# EAGLE design controler scr (EAGLE 7.4.0)
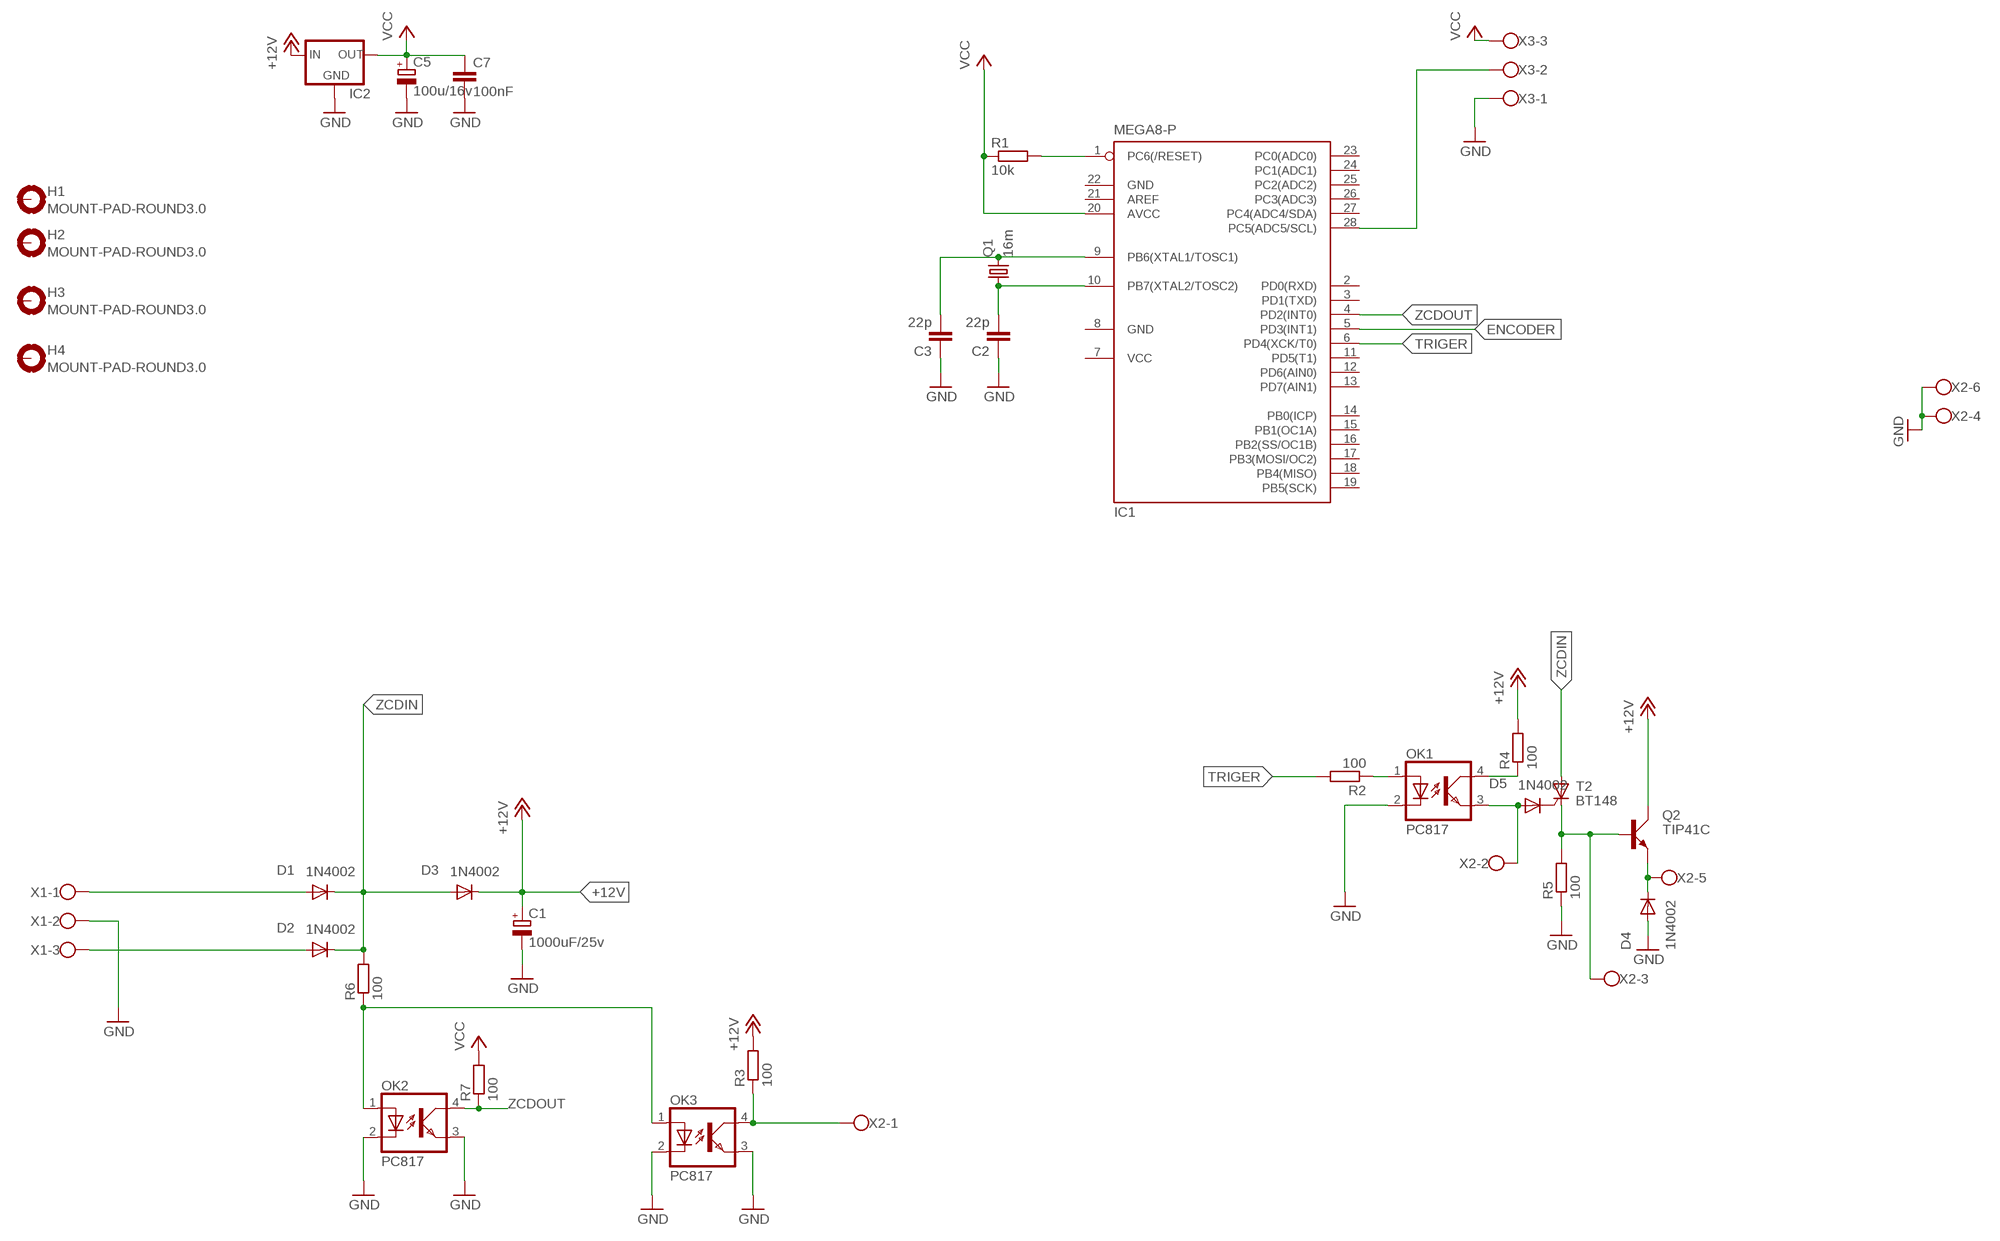
[diagram p0: schematic, sheet 1]

## Parts
C1  1000uF/25v  CPOL-EUE5-10.5  [E5-10,5]
C2  22p  C-EU025-025X050  [C025-025X050]
C3  22p  C-EU025-025X050  [C025-025X050]
C5  100u/16v  CPOL-EUE2.5-5  [E2,5-5]
C7  100nF  C-EU025-025X050  [C025-025X050]
D1  1N4002  1N4446  [DO35-10]
D2  1N4002  1N4446  [DO35-10]
D3  1N4002  1N4446  [DO35-10]
D4  1N4002  1N4446  [DO35-10]
D5  1N4002  1N4446  [DO35-10]
H1  MOUNT-PAD-ROUND3.0  [3,0-PAD]
H2  MOUNT-PAD-ROUND3.0  [3,0-PAD]
H3  MOUNT-PAD-ROUND3.0  [3,0-PAD]
H4  MOUNT-PAD-ROUND3.0  [3,0-PAD]
IC1  MEGA8-P  [DIL28-3]
IC2  78XXS  [78XXS]
OK1  PC817  [DIL04]
OK2  PC817  [DIL04]
OK3  PC817  [DIL04]
Q1  16m  CRYSTALHC49U-V  [HC49U-V]
Q2  TIP41C  [TO220AV]
R1  10k  R-EU_0207/10  [0207/10]
R2  100  R-EU_0207/10  [0207/10]
R3  100  R-EU_0207/10  [0207/10]
R4  100  R-EU_0207/10  [0207/10]
R5  100  R-EU_0207/10  [0207/10]
R6  100  R-EU_0207/10  [0207/10]
R7  100  R-EU_0207/10  [0207/10]
T2  BT148  [SOT82S]
X1  W237-103  [W237-103]
X2  W237-6  [W237-6]
X3  W237-103  [W237-103]

## Nets
+12V: C1.+ D3.C IC2.IN Q2.C R3.2 R4.2
CTA: D1.A X1.1
CTB: D2.A X1.3
ENCODER: IC1.5(PD3(INT1))
GND: C1.- C2.1 C3.1 C5.- C7.2 D4.A IC2.GND OK1.2(C) OK2.2(C) OK2.3(EMIT) OK3.2(C) OK3.3(EMIT) R5.1 X1.2 X2.4 X2.6 X3.1
N$1: IC1.1(PC6(/RESET)) R1.2
N$2: IC1.28(PC5(ADC5/SCL)) X3.2
N$3: D5.C T2.G
N$4: OK2.1(A) OK3.1(A) R6.1
N$5: D4.C Q2.E X2.5
N$6: C3.2 IC1.9(PB6(XTAL1/TOSC1)) Q1.2
N$7: OK3.4(COL) R3.1 X2.1
N$8: C2.2 IC1.10(PB7(XTAL2/TOSC2)) Q1.1
N$9: D5.A OK1.3(EMIT) X2.2
N$10: OK1.4(COL) R4.1
N$20: Q2.B R5.2 T2.C X2.3
N$21: OK1.1(A) R2.1
TRIGER: IC1.6(PD4(XCK/T0)) R2.2
VCC: C5.+ C7.1 IC1.20(AVCC) IC2.OUT R1.1 R7.2 X3.3
ZCDIN: D1.C D2.C D3.A R6.2 T2.A
ZCDOUT: IC1.4(PD2(INT0)) OK2.4(COL) R7.1
Unconnected: H1.B3,0(MOUNT) H2.B3,0(MOUNT) H3.B3,0(MOUNT) H4.B3,0(MOUNT) IC1.2(PD0(RXD)) IC1.3(PD1(TXD)) IC1.11(PD5(T1)) IC1.12(PD6(AIN0)) IC1.13(PD7(AIN1)) IC1.14(PB0(ICP)) IC1.15(PB1(OC1A)) IC1.16(PB2(SS/OC1B)) IC1.17(PB3(MOSI/OC2)) IC1.18(PB4(MISO)) IC1.19(PB5(SCK)) IC1.21(AREF) IC1.23(PC0(ADC0)) IC1.24(PC1(ADC1)) IC1.25(PC2(ADC2)) IC1.26(PC3(ADC3)) IC1.27(PC4(ADC4/SDA))

## Power pins joined to a net without a drawn wire
GND: IC1.8(GND) IC1.22(GND)
VCC: IC1.7(VCC)

## Library data of the parts
C1 C5 = rcl:CPOL-EU: POLARIZED CAPACITOR, European symbol
C2 C3 C7 = rcl:C-EU: CAPACITOR, European symbol
D1-D5 = diode:1N4446: DIODE high speed (Philips)
H1-H4 = holes:MOUNT-PAD-ROUND: MOUNTING PAD, round
IC1 = atmel:MEGA8-P: MICROCONTROLLER 8 Kbytes FLASH, 1 kbytes SRAM, 512 bytes EEPROM, USART, 4-channel 10 bit ADC, 2-channel 8 bit ADC Pin compatible with Atmega48, ATMega88, ATMega168 Source: avr.lbr; OC_FARNELL: unknown; OC_NEWARK: unknown
IC2 = v-reg:78XXS: VOLTAGE REGULATOR
OK1-OK3 = optocoupler:PC817: SHARP OPTO COUPLER; MPN: PC817X4J000F; OC_FARNELL: 9707727; OC_NEWARK: 97K7059
Q1 = crystal:CRYSTAL: CRYSTAL; OC_FARNELL: 1666969; OC_NEWARK: unknown
Q2 = transistor-power:TIP41C: NPN TRANSISTOR
R1-R7 = rcl:R-EU_: RESISTOR, European symbol
T2 = triac:BT148: THYRISTOR
X1 X3 = con-wago-500:W237-103: WAGO SCREW CLAMP; MPN: 237-103; OC_FARNELL: unknown; OC_NEWARK: 18M7116
X2 = con-wago-500:W237-6: WAGO SCREW CLAMP; OC_FARNELL: unknown; OC_NEWARK: unknown

## Board
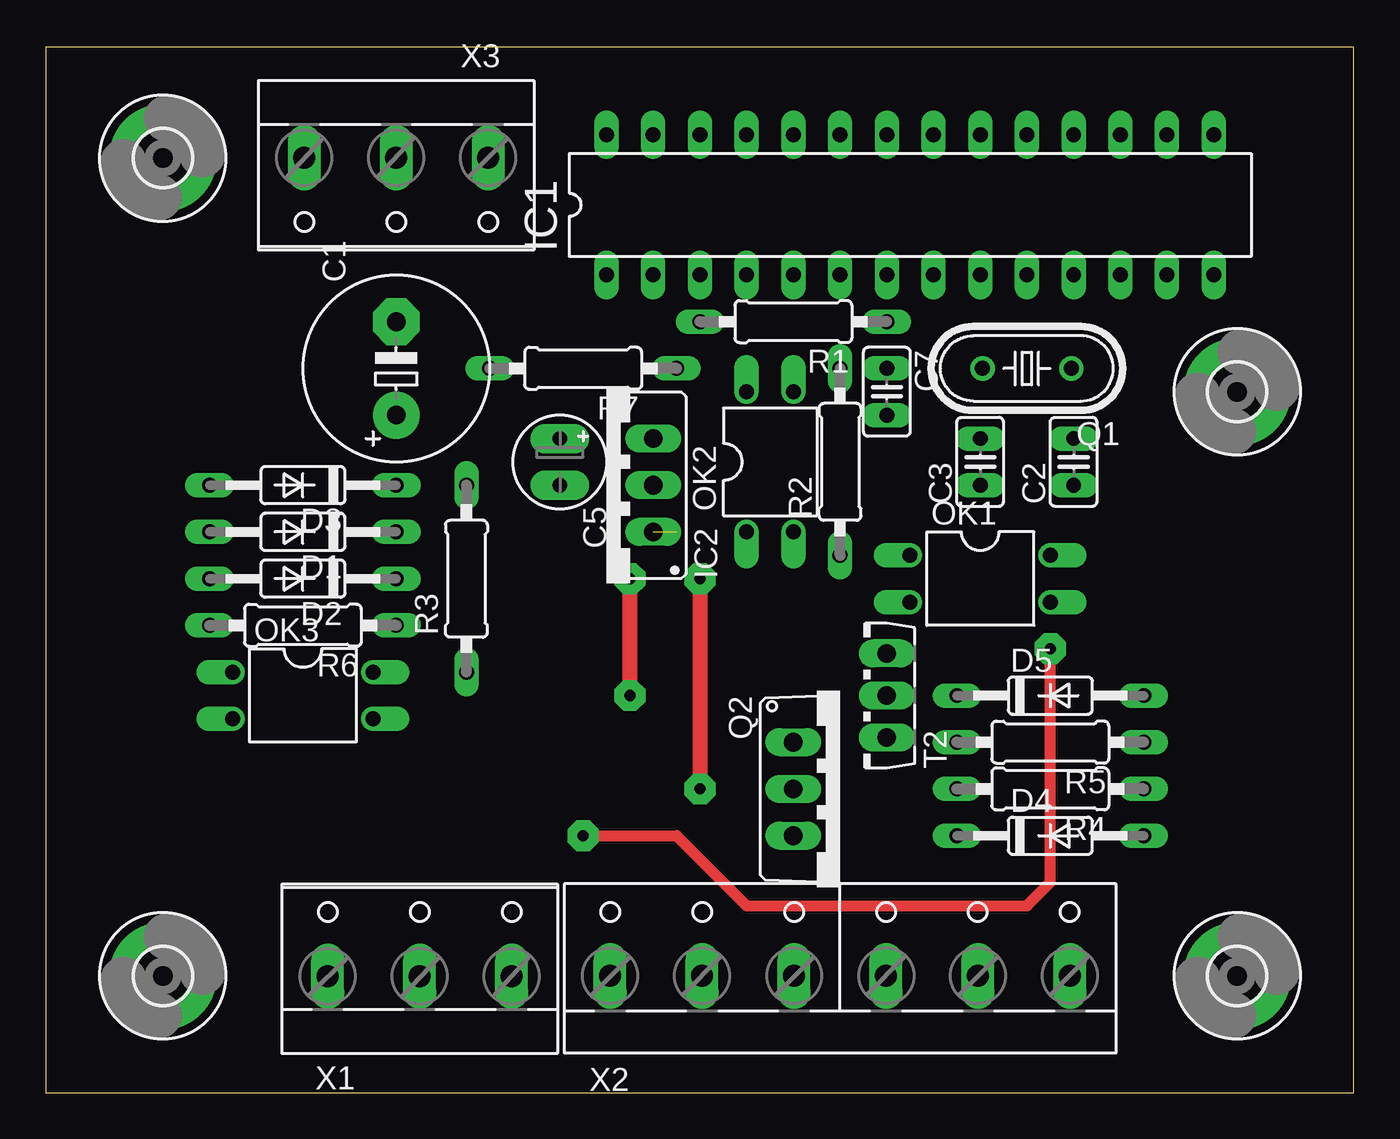
[diagram p1: board, top side]
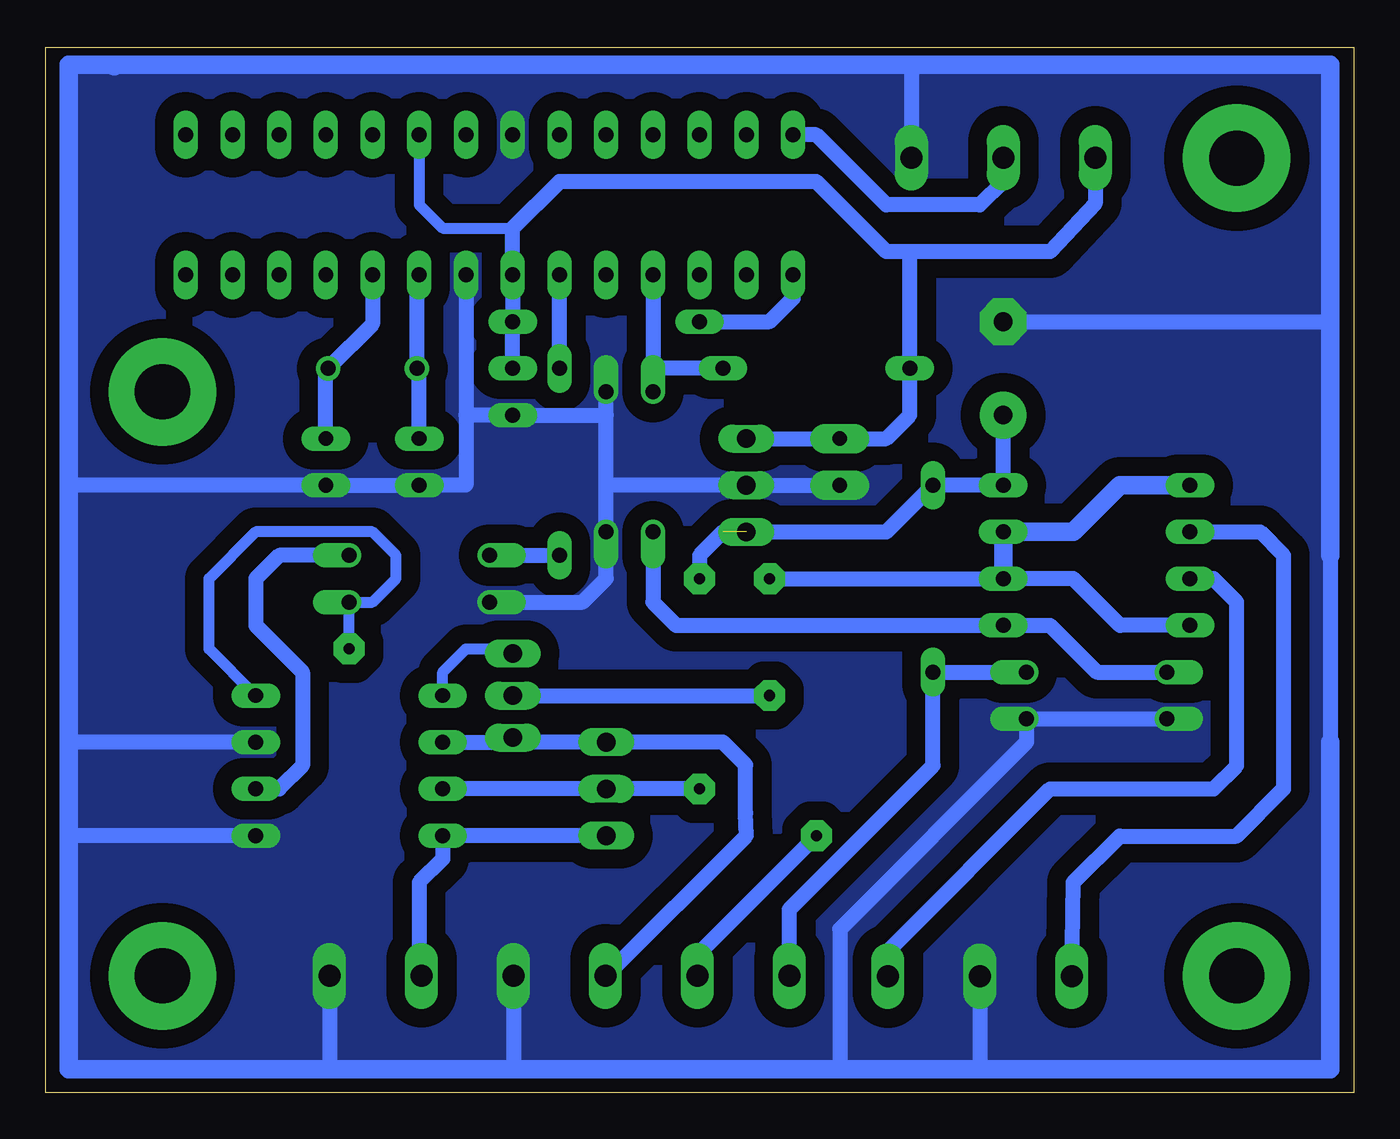
[diagram p2: board, bottom side, seen from below]

Size 71.1 x 56.82 mm. Coordinates in mm from the lower left corner, seen from the top.
Outline: 0,0 71.1,0 71.1,56.82 0,56.82 0,0
Copper layers (1*16): Top 0.035mm / dielectric 1.5mm / Bottom 0.035mm
Design rules "default": minimum track width 10mil, minimum drill 24mil, track to track 8mil, track to pad 8mil, pad to pad 8mil, via to via 8mil, smd to smd 8mil, copper to edge 40mil, drill to drill 8mil, minimum pad ring 10mil, minimum via ring 8mil, stop-mask expansion 4mil, vias tented up to drill 0mil, thermal gap 10mil

### Footprints (pad centres in the part's own frame; a part is rotated, then mirrored left to right if it is on the bottom)
E5-10,5 = drill 1.016 pad 2.54: + -2.54,0 | drill 1.016 pad 2.54 octagon: - 2.54,0
C025-025X050 = drill 0.813 long: 1 -1.27,0; 2 1.27,0
E2,5-5 = drill 0.813 pad 1.6 long: + -1.27,0; - 1.27,0
DO35-10 = drill 0.813 long: A 5.08,0; C -5.08,0
3,0-PAD = drill 3 pad 5.842: B3,0 0,0
DIL28-3 = drill 0.813 long: 1 -16.51,-3.81; 2 -13.97,-3.81; 3 -11.43,-3.81; 4 -8.89,-3.81; 5 -6.35,-3.81; 6 -3.81,-3.81; 7 -1.27,-3.81; 8 1.27,-3.81; 9 3.81,-3.81; 10 6.35,-3.81; 11 8.89,-3.81; 12 11.43,-3.81; 13 13.97,-3.81; 14 16.51,-3.81; 15 16.51,3.81; 16 13.97,3.81; 17 11.43,3.81; 18 8.89,3.81; 19 6.35,3.81; 20 3.81,3.81; 21 1.27,3.81; 22 -1.27,3.81; 23 -3.81,3.81; 24 -6.35,3.81; 25 -8.89,3.81; 26 -11.43,3.81; 27 -13.97,3.81; 28 -16.51,3.81
78XXS = drill 1.016 long: GND 0,-2.54; IN -2.54,-2.54; OUT 2.54,-2.54
DIL04 = drill 0.813 offset: 1 -1.27,-3.81; 2 1.27,-3.81; 3 1.27,3.81; 4 -1.27,3.81
HC49U-V = drill 0.813: 1 -2.413,0; 2 2.413,0
TO220AV = drill 1.016 long: B -2.54,-2.54; C 0,-2.54; E 2.54,-2.54
0207/10 = drill 0.813 long: 1 -5.08,0; 2 5.08,0
SOT82S = drill 1.016 long: A 0,-1.27; C -2.286,-1.27; G 2.286,-1.27
W237-103 = drill 1.194 long: 1 -5,-1.29; 2 0,-1.29; 3 5,-1.29
W237-6 = drill 1.194 long: 1 -12.5,-1.27; 2 -7.5,-1.27; 3 -2.5,-1.27; 4 2.5,-1.27; 5 7.5,-1.27; 6 12.5,-1.27

### Placement (x,y rotation side)
C1  19.05,39.37 90 top
C2  55.88,34.29 90 top
C3  50.8,34.29 90 top
C5  27.94,34.29 270 top
C7  45.72,38.1 270 top
D1  13.97,30.48 180 top
D2  13.97,27.94 180 top
D3  13.97,33.02 180 top
D4  54.61,13.97 0 top
D5  54.61,21.59 0 top
H1  6.35,6.35 0 top
H2  64.77,6.35 0 top
H3  64.77,38.1 0 top
H4  6.35,50.8 0 top
IC1  46.99,48.26 0 top
IC2  30.48,33.02 90 top
OK1  50.8,27.94 270 top
OK2  39.37,34.29 0 top
OK3  13.97,21.59 270 top
Q1  53.34,39.37 180 top
Q2  43.18,16.51 270 top
R1  40.64,41.91 180 top
R2  43.18,34.29 90 top
R3  22.86,27.94 90 top
R4  54.61,16.51 180 top
R5  54.61,19.05 180 top
R6  13.97,25.4 180 top
R7  29.21,39.37 180 top
T2  44.45,21.59 90 top
X1  20.32,7.62 0 top
X2  43.18,7.62 0 top
X3  19.05,49.53 180 top

### Tracks (layer width: path | path; a pad name or v marks a point on that pad's centre or on a via)
+12V  (via drill 0.6 pad 1.68)  (1 unrouted)
  Top 0.813: v35.56,27.94 v35.56,16.51
  Bottom 0.813: R4.2 Q2.C v35.56,16.51 | 34.29,30.48 35.56,29.21 v35.56,27.94 | C1.+ D3.C R3.2 25.4,30.48 IC2.IN
CTA
  Bottom 0.813: X1.1 15.24,11.43 12.72,13.95 6.37,13.95 3.81,16.51 3.81,29.21 5.08,30.48 D1.A
CTB
  Bottom 0.813: X1.3 25.32,7.7 16.51,16.51 7.62,16.51 6.35,17.78 6.35,26.67 7.62,27.94 D2.A
GND
  Bottom 0.61: 69.77,32.94 69.85,33.02
  Bottom 0.813: IC1.8 48.26,36.83 | 48.26,36.83 48.26,33.02 C3.1 C2.1 69.69,33.02 69.77,32.94 | 1.27,29.21 1.27,19.05 | 24.05,55.8 X3.1 | 48.26,36.83 C7.2 40.64,36.83 | OK3.2 OK3.3 17.78,19.05 27.94,8.89 27.94,1.27 | 40.64,36.83 OK2.3 | 40.64,33.02 OK2.2 40.64,27.94 41.91,26.67 OK1.2 | 40.64,33.02 40.64,36.83 | D4.A 69.85,13.97 | X2.4 45.68,1.31 45.72,1.27 | X2.6 55.68,1.47 55.88,1.27 | R5.1 69.85,19.05 | X1.2 20.32,1.27 | C5.- IC2.GND 40.64,33.02 | C1.- 1.27,41.91
  Bottom 1.016: 1.27,19.05 1.27,1.27 20.32,1.27 27.94,1.27 45.72,1.27 55.88,1.27 69.85,1.27 69.85,13.97 69.85,19.05 69.85,33.02 69.85,55.88 67.31,55.88 | 67.31,55.88 24.13,55.88 | 24.13,55.88 1.27,55.88 1.27,41.91 1.27,29.21 | 24.05,55.8 24.13,55.88 | 67.39,55.8 67.31,55.88
  pour Bottom (isolate 1.016, no thermals): 0,57.15 71.12,57.15 71.12,0 0,0
N$1
  Bottom 0.813: R1.2 31.75,41.91 30.48,43.18 IC1.1
N$2
  Bottom 0.813: X3.2 19.05,49.53 20.32,48.26 25.4,48.26 29.21,52.07 IC1.28
N$3
  Bottom 0.61: D5.C 49.53,22.86 48.26,24.13 45.97,24.13 T2.G
N$4
  Bottom 0.813: OK3.1 13.97,22.86 16.51,25.4 R6.1 36.83,25.4 38.1,26.67 OK2.1
N$5
  Bottom 0.813: Q2.E D4.C 49.53,12.7 50.8,11.43 50.8,6.47 X2.5
N$6
  Bottom 0.813: IC1.9 50.93,44.32 Q1.2 50.8,39.24 C3.2
N$7
  Bottom 0.813: OK3.4 R3.1 22.86,17.78 30.68,9.96 X2.1
N$8
  Bottom 0.813: IC1.10 53.34,41.78 Q1.1 55.88,39.24 C2.2
N$9  (via drill 0.6 pad 1.68)
  Top 0.61: v29.21,13.97 34.29,13.97 38.1,10.16 53.34,10.16 54.61,11.43 v54.61,24.13
  Bottom 0.61: D5.A 62.23,24.13 62.23,27.94 59.69,30.48 53.34,30.48 52.07,29.21 52.07,27.94 53.34,26.67 OK1.3 v54.61,24.13
  Bottom 0.813: v29.21,13.97 35.56,7.62 35.56,6.47 X2.2
N$10
  Bottom 0.813: OK1.4 58.42,29.21 59.69,27.94 59.69,25.4 57.15,22.86 57.15,17.78 58.42,16.51 R4.1
N$20
  Bottom 0.813: X2.3 40.64,6.35 33.02,13.97 33.06,15.2 33.06,17.82 34.29,19.05 Q2.B 45.47,19.05 T2.C 45.97,19.05 R5.2
N$21
  Bottom 0.813: OK1.1 R2.1
TRIGER
  Bottom 0.813: R2.2 IC1.6
VCC
  Bottom 0.61: IC1.20 50.8,48.26 49.53,46.99 45.72,46.99
  Bottom 0.813: 24.13,45.72 16.51,45.72 14.05,48.34 X3.3 | 24.13,45.72 25.4,45.72 29.21,49.53 43.18,49.53 45.72,46.99 IC1.7 R1.1 C7.1 | IC2.OUT C5.+ 25.4,35.56 24.13,36.83 R7.2 24.13,45.72
ZCDIN  (via drill 0.6 pad 1.68)
  Top 0.813: v31.75,21.59 v31.75,27.94
  Bottom 0.813: R6.2 12.7,25.4 15.24,27.94 D2.C v31.75,27.94 | T2.A v31.75,21.59
  Bottom 1.016: D3.A 12.7,33.02 15.24,30.48 D1.C D2.C
ZCDOUT
  Bottom 0.813: IC1.4 38.1,39.37 | R7.1 38.1,39.37 | 38.1,39.37 OK2.4